# EAGLE design G22V1 (EAGLE 9.6.2)
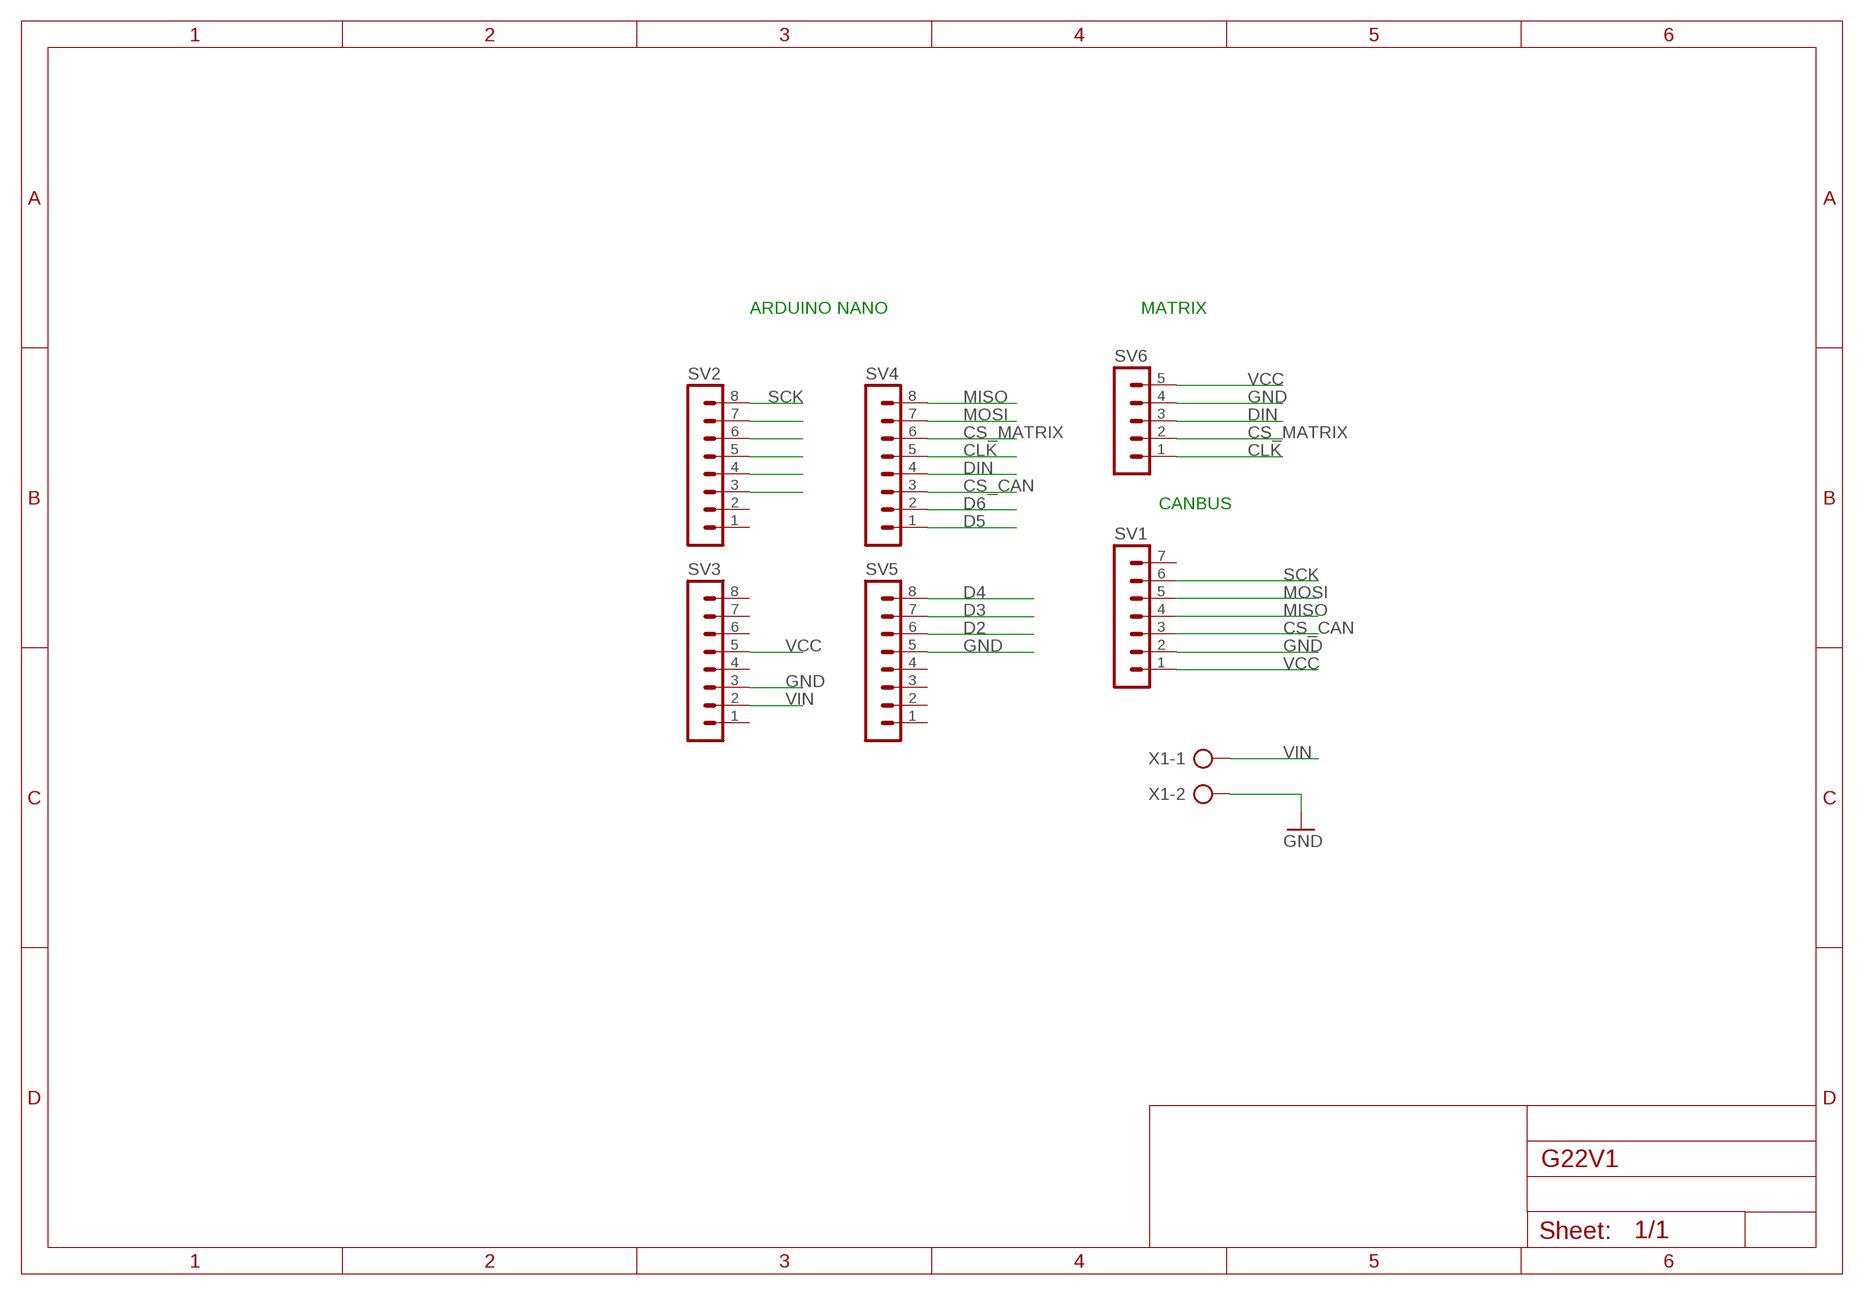
[diagram p0: schematic, sheet 1]

## Parts
SV1  MA07-1  [MA07-1]
SV2  MA08-1  [MA08-1]
SV3  MA08-1  [MA08-1]
SV4  MA08-1  [MA08-1]
SV5  MA08-1  [MA08-1]
SV6  MA05-1  [MA05-1]
X1  AK300/2  [AK300/2]

## Nets
CLK: SV4.5 SV6.1
CS_CAN: SV1.3 SV4.3
CS_MATRIX: SV4.6 SV6.2
D2: SV5.6
D3: SV5.7
D4: SV5.8
D5: SV4.1
D6: SV4.2
DIN: SV4.4 SV6.3
GND: SV1.2 SV3.3 SV5.5 SV6.4 X1.2
MISO: SV1.4 SV4.8
MOSI: SV1.5 SV4.7
N$2: SV2.7
N$3: SV2.6
N$4: SV2.5
N$5: SV2.4
N$6: SV2.3
SCK: SV1.6 SV2.8
VCC: SV1.1 SV3.5 SV6.5
VIN: SV3.2 X1.1
Unconnected: SV1.7 SV2.1 SV2.2 SV3.1 SV3.4 SV3.6 SV3.7 SV3.8 SV5.1 SV5.2 SV5.3 SV5.4

## Notes on the sheet
- ARDUINO NANO | MATRIX
- CANBUS

## Library data of the parts
SV1 = con-lstb:MA07-1: PIN HEADER; OC_FARNELL: unknown; OC_NEWARK: unknown
SV2-SV5 = con-lstb:MA08-1: PIN HEADER; OC_FARNELL: unknown; OC_NEWARK: unknown
SV6 = con-lstb:MA05-1: PIN HEADER; OC_FARNELL: unknown; OC_NEWARK: unknown
X1 = con-ptr500:AK300/2: CONNECTOR; OC_FARNELL: unknown; OC_NEWARK: unknown

## Board
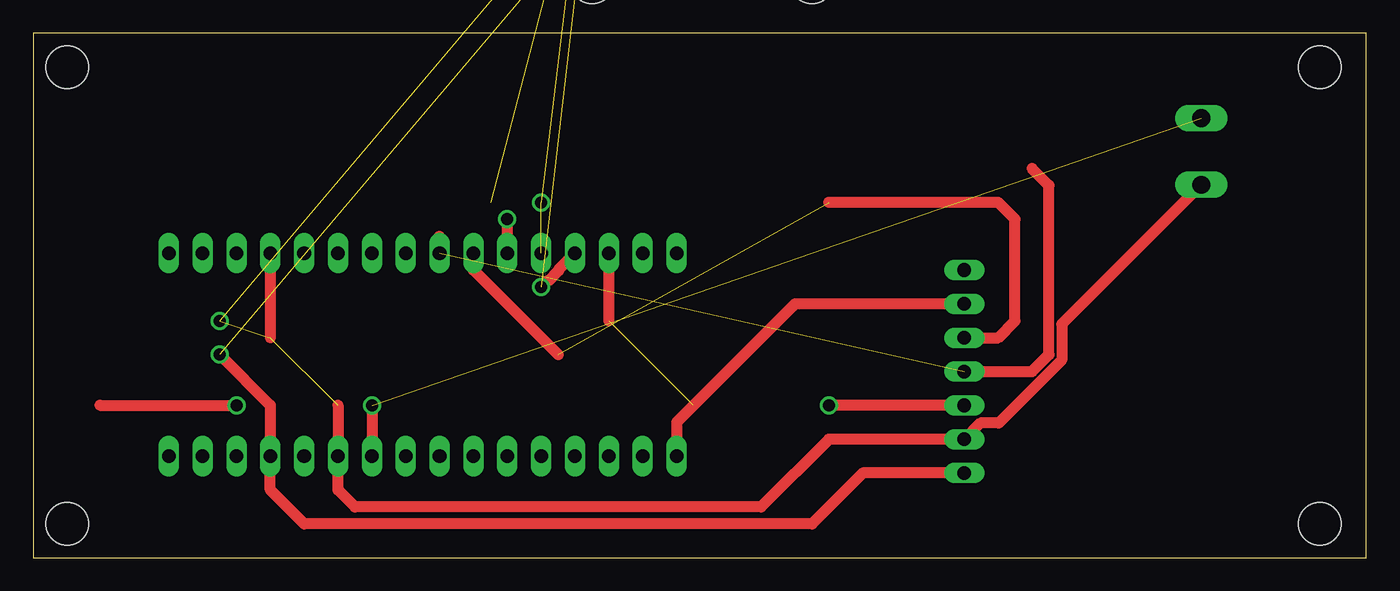
[diagram p1: board, top side]
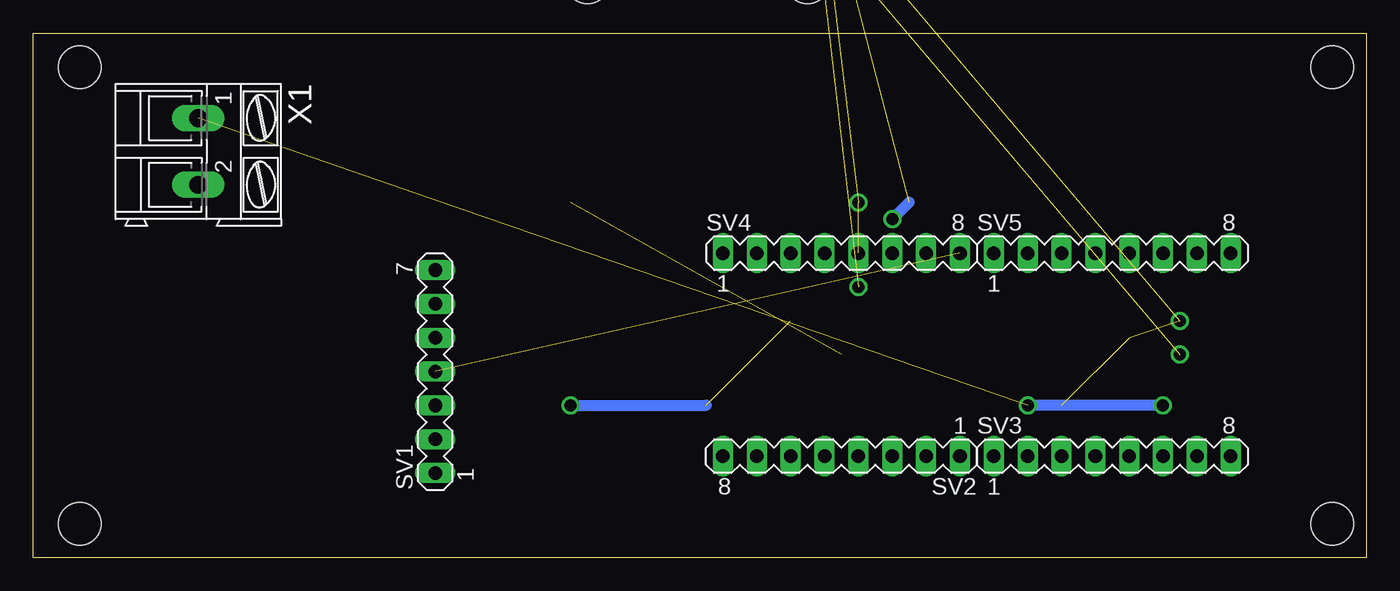
[diagram p2: board, bottom side, seen from below]

Size 100 x 39.36 mm. Coordinates in mm from the lower left corner, seen from the top.
Outline: 0,0 100,0 100,39.36 0,39.36 0,0
Copper layers (1*16): Top 0.035mm / dielectric 1.5mm / Bottom 0.035mm
Design rules "default": minimum track width 6mil, minimum drill 0.35mm, track to track 6mil, track to pad 6mil, pad to pad 6mil, via to via 6mil, smd to smd 6mil, copper to edge 40mil, drill to drill 6mil, minimum pad ring 10mil, minimum via ring 8mil, stop-mask expansion 4mil, vias tented up to drill 0mil, thermal gap 10mil
Holes 3.2 mm at 2.54,36.83 2.54,2.54 96.52,2.54 96.52,36.83 41.91,62.23 41.91,43.18 58.42,43.18 57.15,59.56

### Footprints (pad centres in the part's own frame; a part is rotated, then mirrored left to right if it is on the bottom)
MA07-1 = drill 1.016 long: 1 -7.62,0; 2 -5.08,0; 3 -2.54,0; 4 0,0; 5 2.54,0; 6 5.08,0; 7 7.62,0
MA08-1 = drill 1.016 long: 1 -8.89,0; 2 -6.35,0; 3 -3.81,0; 4 -1.27,0; 5 1.27,0; 6 3.81,0; 7 6.35,0; 8 8.89,0
MA05-1 = drill 1.016 long: 1 -5.08,0; 2 -2.54,0; 3 0,0; 4 2.54,0; 5 5.08,0
AK300/2 = drill 1.321 long: 1 -2.515,0; 2 2.489,0

### Placement (x,y rotation side)
SV1  69.85,13.97 90 bottom
SV2  39.37,7.62 180 bottom
SV3  19.05,7.62 0 bottom
SV4  39.37,22.86 0 bottom
SV5  19.05,22.86 0 bottom
SV6  41.91,53.34 270 top  (outside the outline)
X1  87.63,30.48 270 bottom

### Tracks (layer width: path | path; a pad name or v marks a point on that pad's centre or on a via)
CLK  (via drill 0.9)  (2 unrouted)
  other vias: 38.1,26.67
CS_CAN  (via drill 0.9)  (1 unrouted)
  Top 0.813: SV1.3 v59.69,11.43 | 43.18,17.78 SV4.3
  Bottom 0.813: v59.69,11.43 49.53,11.43
CS_MATRIX  (via drill 0.9)  (1 unrouted)
  Top 0.813: v35.56,25.4 SV4.6
  Bottom 0.813: 34.29,26.67 v35.56,25.4
DIN  (via drill 0.9)  (1 unrouted)
  Top 0.813: v38.1,20.32 38.56,20.78 38.65,20.78 39.42,21.55 39.42,21.64 SV4.4
GND  (via drill 0.9)  (3 unrouted)
  Top 0.813: SV5.5 17.78,16.51 | 22.86,11.43 SV3.3 22.86,5.08 24.13,3.81 54.61,3.81 59.69,8.89 SV1.2 71.07,10.11 72.43,10.11 77.17,14.84 77.17,17.53 X1.2
  other vias: 13.97,17.78
MISO  (1 unrouted)
  Top 0.813: SV1.4 74.93,13.97 76.2,15.24 76.2,27.94 74.93,29.21 | 30.48,24.13 SV4.8
MOSI  (1 unrouted)
  Top 0.813: SV1.5 72.39,16.51 73.66,17.78 73.66,25.4 72.39,26.67 59.69,26.67 | 39.37,15.24 33.02,21.59 SV4.7
SCK
  Top 0.813: SV2.8 48.26,10.16 57.15,19.05 SV1.6
VCC  (via drill 0.9)  (1 unrouted)
  Top 0.813: SV1.1 62.23,6.35 58.42,2.54 20.32,2.54 17.78,5.08 SV3.5 17.78,11.43 v13.97,15.24
VIN  (via drill 0.9)  (1 unrouted)
  Top 0.813: 4.99,11.43 v15.24,11.43 | v25.4,11.43 SV3.2
  Bottom 0.813: v15.24,11.43 v25.4,11.43